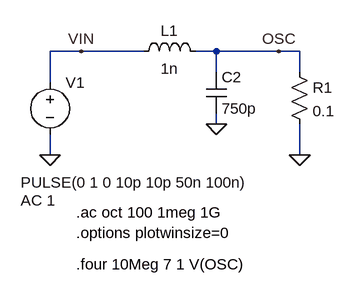
[diagram p0: schematic harmonic_03_pulse_lpf_ac.asc]
harmonic_03_pulse_lpf_ac.asc, the LTspice schematic file:
Version 4
SHEET 1 880 680
WIRE 48 64 0 64
WIRE 144 64 48 64
WIRE 256 64 224 64
WIRE 352 64 256 64
WIRE 384 64 352 64
WIRE 256 96 256 64
WIRE 384 96 384 64
WIRE 0 112 0 64
WIRE 256 176 256 160
WIRE 0 224 0 192
WIRE 384 224 384 176
FLAG 0 224 0
FLAG 384 224 0
FLAG 352 64 OSC
FLAG 256 176 0
FLAG 48 64 VIN
SYMBOL voltage 0 96 R0
WINDOW 3 -45 170 Left 2
WINDOW 123 -45 198 Left 2
WINDOW 39 0 0 Left 0
SYMATTR Value PULSE(0 1 0 10p 10p 50n 100n)
SYMATTR Value2 AC 1
SYMATTR InstName V1
SYMBOL res 368 80 R0
SYMATTR InstName R1
SYMATTR Value 0.1
SYMBOL cap 240 96 R0
SYMATTR InstName C2
SYMATTR Value 750p
SYMBOL ind 128 80 R270
WINDOW 0 32 56 VTop 2
WINDOW 3 5 56 VBottom 2
SYMATTR InstName L1
SYMATTR Value 1n
TEXT 40 312 Left 2 !.ac oct 100 1meg 1G
TEXT 40 344 Left 2 !.options plotwinsize=0
TEXT 40 392 Left 2 !.four 10Meg 7 1 V(OSC)

The netlist it stands for:
* harmonic_03_pulse_lpf_ac.asc
V1 VIN 0 PULSE(0 1 0 10p 10p 50n 100n) AC 1
R1 OSC 0 0.1
C2 OSC 0 750p
L1 VIN OSC 1n
.ac oct 100 1meg 1G
.options plotwinsize=0
.four 10Meg 7 1 V(OSC)
.backanno
.end